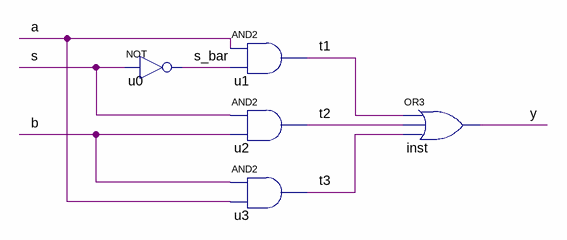
[diagram p0: schematic sheet]
// Quartus schematic Block1.bdf as structural Verilog: 5 symbols, 0 pins
module Block1 (
);

  wire a, b, s, s_bar, t1, t2, t3, y;

  not u0 (s_bar, s);
  and u1 (t1, a, s_bar);
  and u2 (t2, s, b);
  and u3 (t3, b, a);
  or inst (y, t1, t2, t3);
endmodule
